# EAGLE design Aquila-2018-Under2 (EAGLE 9.1.1)
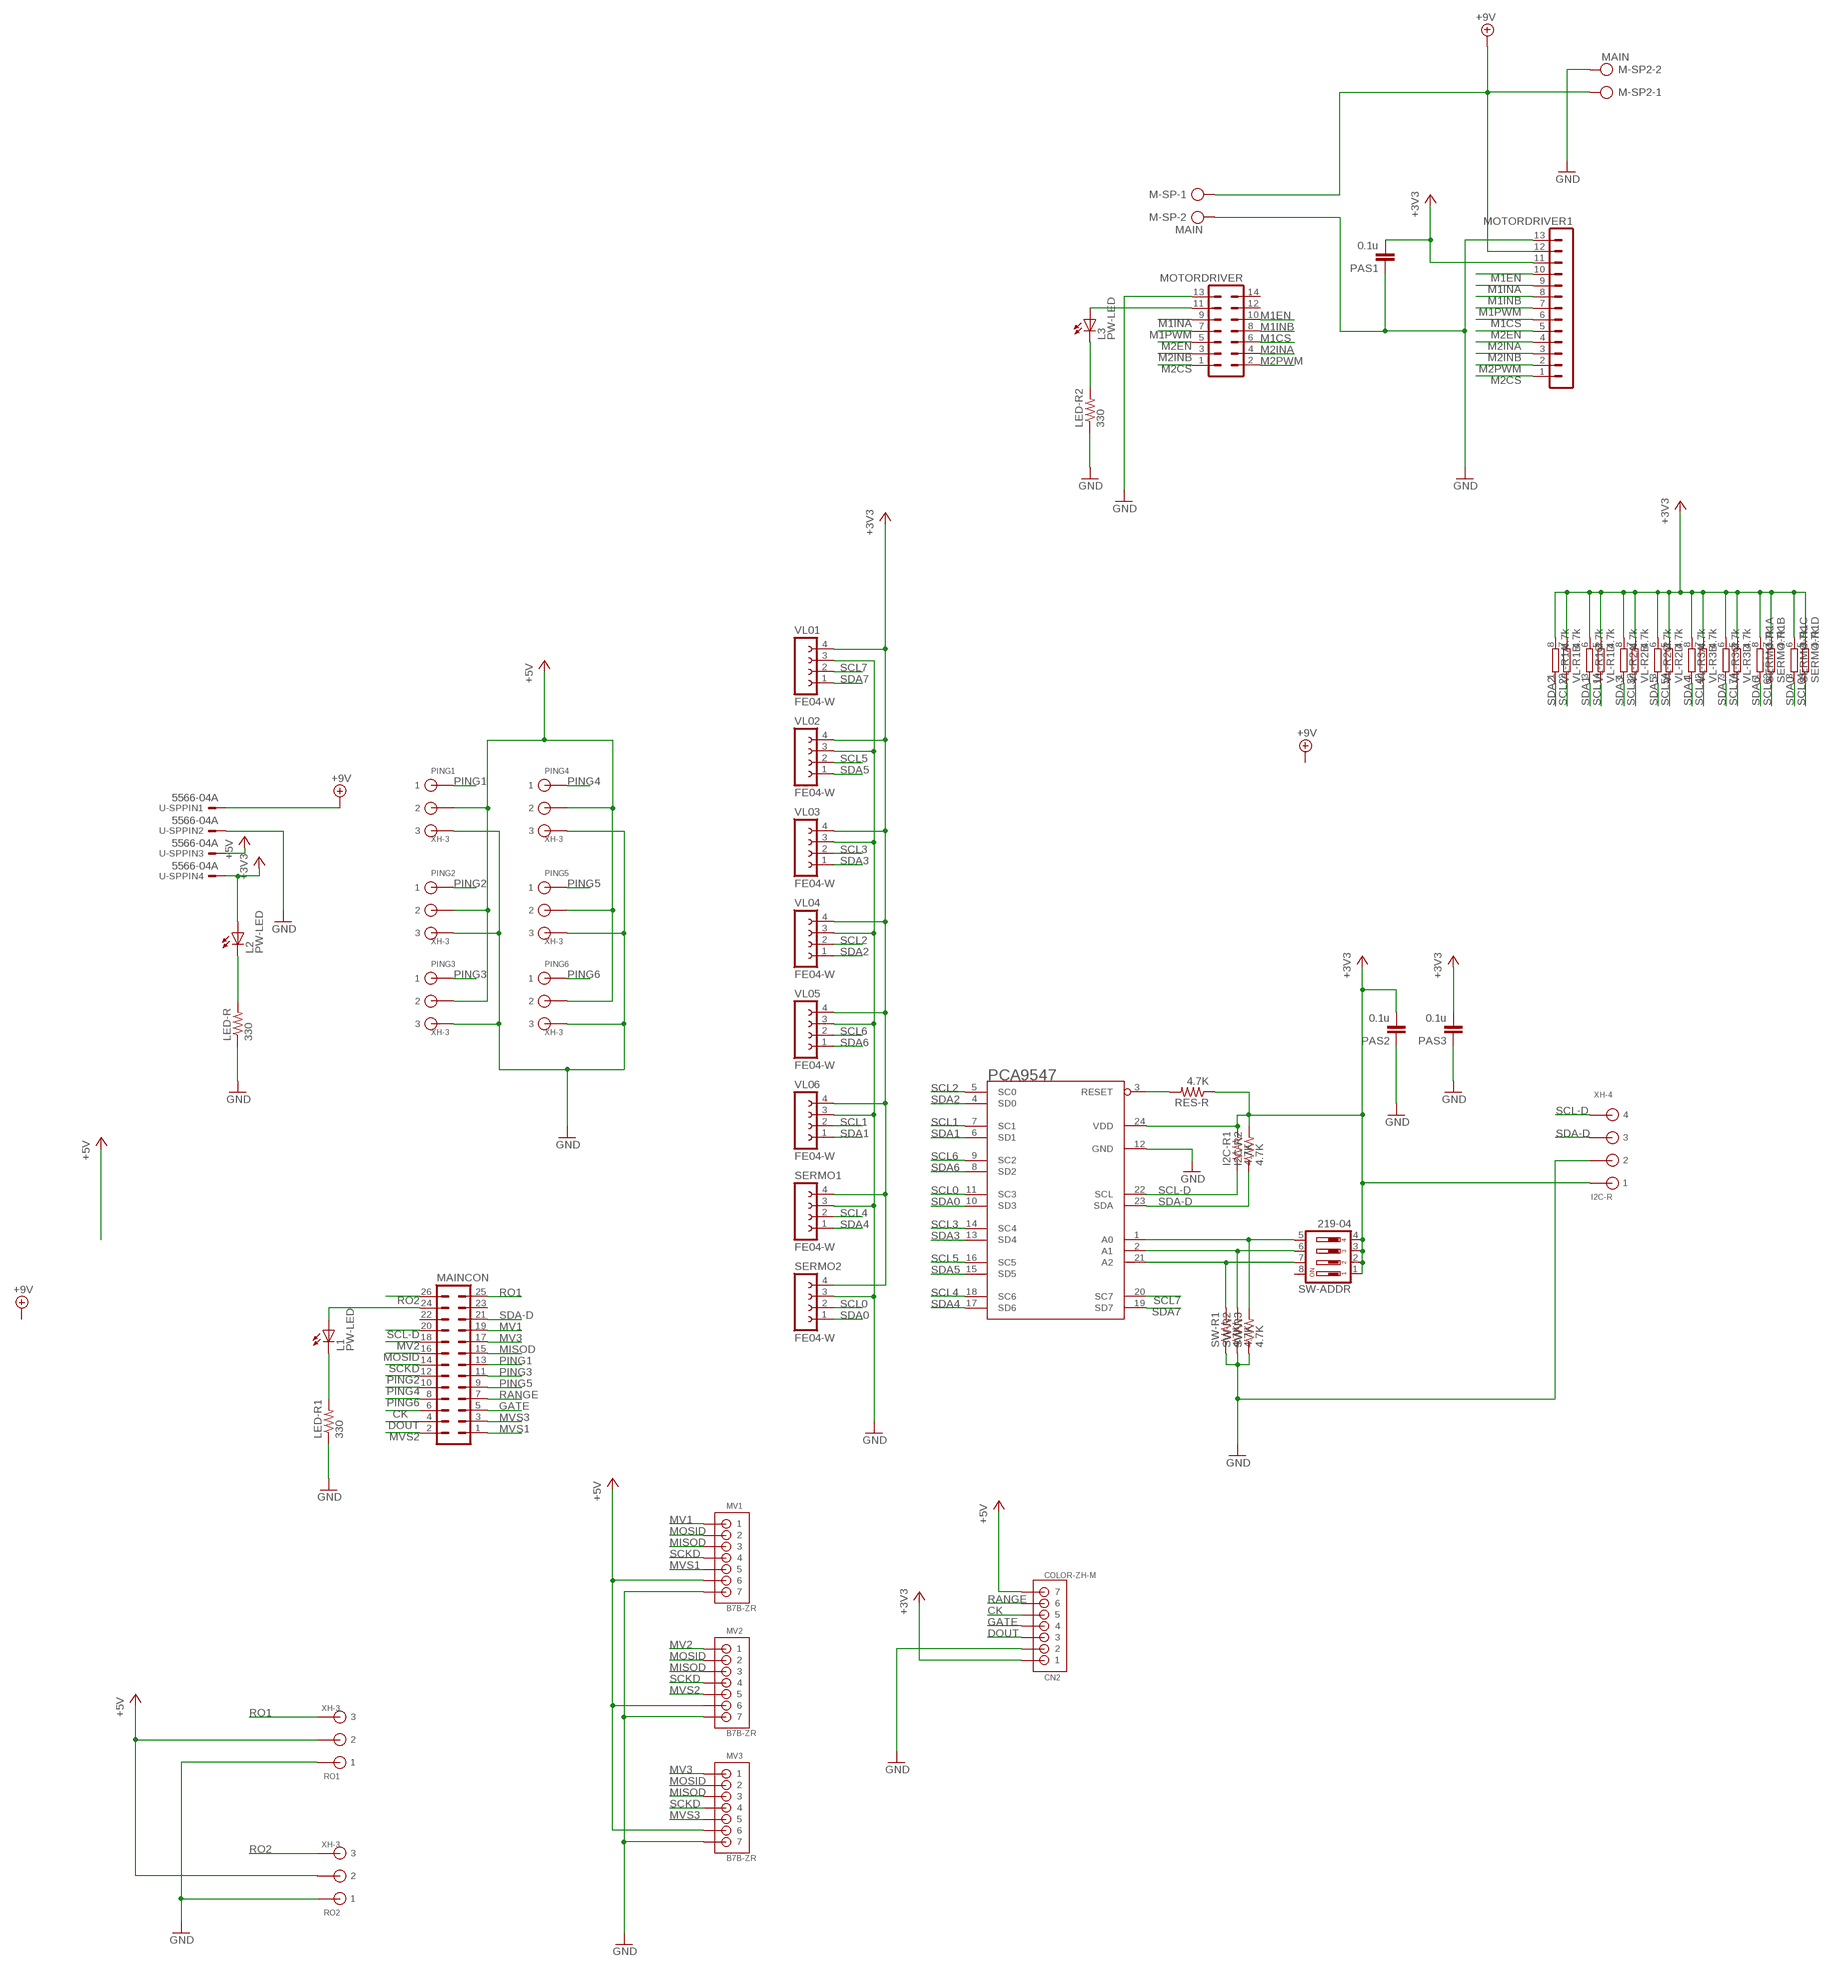
[diagram p0: schematic, sheet 1]

## Parts
CN2  COLOR-ZH-M  B7B-ZR  [B7B-ZR]
I2C-R  XH-4  [CON4]
I2C-R1  4.7K  R-US_R0805  [R0805]
I2C-R2  4.7K  R-US_R0805  [R0805]
L1  PW-LED  LEDCHIPLED_0805  [CHIPLED_0805]
L2  PW-LED  LEDCHIPLED_0805  [CHIPLED_0805]
L3  PW-LED  LEDCHIPLED_0805  [CHIPLED_0805]
LED-R  330  R-US_R0805  [R0805]
LED-R1  330  R-US_R0805  [R0805]
LED-R2  330  R-US_R0805  [R0805]
M-SP  MAIN  AK500/2  [AK500/2]
M-SP2  MAIN  AK500/2  [AK500/2]
MAINCON  ML26  [ML26]
MOTORDRIVER  ML14  [ML14]
MOTORDRIVER1  MA13-1  [MA13-1]
MV1  B7B-ZR  [B7B-ZR]
MV2  B7B-ZR  [B7B-ZR]
MV3  B7B-ZR  [B7B-ZR]
PAS1  0.1u  C-EUC0805  [C0805]
PAS2  0.1u  C-EUC0805  [C0805]
PAS3  0.1u  C-EUC0805  [C0805]
PCA9547  PCA9547  [SO24L]
PING1  XH-3  [CON3]
PING2  XH-3  [CON3]
PING3  XH-3  [CON3]
PING4  XH-3  [CON3]
PING5  XH-3  [CON3]
PING6  XH-3  [CON3]
RES-R  4.7K  R-US_R0805  [R0805]
RO1  XH-3  [CON3]
RO2  XH-3  [CON3]
SERMO1  FE04-W  [FE04-W]
SERMO2  FE04-W  [FE04-W]
SERMO-R1  4.7k  4R-NEXB28V  [EXB28V]
SW-ADDR  219-04  [CTS-219-04]
SW-R1  4.7K  R-US_R0805  [R0805]
SW-R2  4.7K  R-US_R0805  [R0805]
SW-R3  4.7K  R-US_R0805  [R0805]
U-SP  5566-04A  [5566-04A]
VL01  FE04-W  [FE04-W]
VL02  FE04-W  [FE04-W]
VL03  FE04-W  [FE04-W]
VL04  FE04-W  [FE04-W]
VL05  FE04-W  [FE04-W]
VL06  FE04-W  [FE04-W]
VL-R1  4.7k  4R-NEXB28V  [EXB28V]
VL-R2  4.7k  4R-NEXB28V  [EXB28V]
VL-R3  4.7k  4R-NEXB28V  [EXB28V]

## Nets
+3V3: CN2.1 I2C-R1.2 I2C-R2.2 I2C-R.P$1 L2.A MOTORDRIVER1.11 PAS1.2 PAS2.2 PAS3.2 PCA9547.24(VDD) RES-R.1 SERMO1.4 SERMO2.4 SERMO-R1.5 SERMO-R1.6 SERMO-R1.7 SERMO-R1.8 SW-ADDR.1 SW-ADDR.2 SW-ADDR.3 SW-ADDR.4 U-SP.4 VL01.4 VL02.4 VL03.4 VL04.4 VL05.4 VL06.4 VL-R1.5 VL-R1.6 VL-R1.7 VL-R1.8 VL-R2.5 VL-R2.6 VL-R2.7 VL-R2.8 VL-R3.5 VL-R3.6 VL-R3.7 VL-R3.8
+5V: CN2.7 MV1.6 MV2.6 MV3.6 PING1.P$2 PING2.P$2 PING3.P$2 PING4.P$2 PING5.P$2 PING6.P$2 RO1.P$2 RO2.P$2 U-SP.3
+9V: M-SP2.1 M-SP.1 MOTORDRIVER1.12 U-SP.1
CK: CN2.5 MAINCON.6
DOUT: CN2.3 MAINCON.4
GATE: CN2.4 MAINCON.5
GND: CN2.2 I2C-R.P$2 LED-R1.1 LED-R2.1 LED-R.1 M-SP2.2 M-SP.2 MOTORDRIVER1.13 MOTORDRIVER.13 MV1.7 MV2.7 MV3.7 PAS1.1 PAS2.1 PAS3.1 PCA9547.12(GND) PING1.P$3 PING2.P$3 PING3.P$3 PING4.P$3 PING5.P$3 PING6.P$3 RO1.P$1 RO2.P$1 SERMO1.3 SERMO2.3 SW-R1.1 SW-R2.1 SW-R3.1 U-SP.2 VL01.3 VL02.3 VL03.3 VL04.3 VL05.3 VL06.3
M1CS: MOTORDRIVER1.6 MOTORDRIVER.6
M1EN: MOTORDRIVER1.10 MOTORDRIVER.10
M1INA: MOTORDRIVER1.9 MOTORDRIVER.9
M1INB: MOTORDRIVER1.8 MOTORDRIVER.8
M1PWM: MOTORDRIVER1.7 MOTORDRIVER.7
M2CS: MOTORDRIVER1.1 MOTORDRIVER.1
M2EN: MOTORDRIVER1.5 MOTORDRIVER.5
M2INA: MOTORDRIVER1.4 MOTORDRIVER.4
M2INB: MOTORDRIVER1.3 MOTORDRIVER.3
M2PWM: MOTORDRIVER1.2 MOTORDRIVER.2
MISOD: MAINCON.15 MV1.3 MV2.3 MV3.3
MOSID: MAINCON.16 MV1.2 MV2.2 MV3.2
MV1: MAINCON.19 MV1.1
MV2: MAINCON.18 MV2.1
MV3: MAINCON.17 MV3.1
MVS1: MAINCON.1 MV1.5
MVS2: MAINCON.2 MV2.5
MVS3: MAINCON.3 MV3.5
N$1: PCA9547.1(A0) SW-ADDR.5 SW-R3.2
N$2: PCA9547.2(A1) SW-ADDR.6 SW-R2.2
N$3: PCA9547.21(A2) SW-ADDR.7 SW-R1.2
N$4: L2.C LED-R.2
N$5: PCA9547.3(RESET) RES-R.2
N$7: L1.C LED-R1.2
N$8: L1.A MAINCON.24
N$9: L3.C LED-R2.2
N$10: L3.A MOTORDRIVER.11
PING1: MAINCON.13 PING1.P$1
PING2: MAINCON.12 PING2.P$1
PING3: MAINCON.11 PING3.P$1
PING4: MAINCON.10 PING4.P$1
PING5: MAINCON.9 PING5.P$1
PING6: MAINCON.8 PING6.P$1
RANGE: CN2.6 MAINCON.7
RO1: MAINCON.25 RO1.P$3
RO2: MAINCON.26 RO2.P$3
SCKD: MAINCON.14 MV1.4 MV2.4 MV3.4
SCL0: PCA9547.11(SC3) SERMO2.2 SERMO-R1.4
SCL1: PCA9547.7(SC1) VL06.2 VL-R1.4
SCL2: PCA9547.5(SC0) VL04.2 VL-R1.2
SCL3: PCA9547.14(SC4) VL03.2 VL-R2.2
SCL4: PCA9547.18(SC6) SERMO1.2 VL-R3.2
SCL5: PCA9547.16(SC5) VL02.2 VL-R2.4
SCL6: PCA9547.9(SC2) SERMO-R1.2 VL05.2
SCL7: PCA9547.20(SC7) VL01.2 VL-R3.4
SCL-D: I2C-R1.1 I2C-R.P$4 MAINCON.20 PCA9547.22(SCL)
SDA0: PCA9547.10(SD3) SERMO2.1 SERMO-R1.3
SDA1: PCA9547.6(SD1) VL06.1 VL-R1.3
SDA2: PCA9547.4(SD0) VL04.1 VL-R1.1
SDA3: PCA9547.13(SD4) VL03.1 VL-R2.1
SDA4: PCA9547.17(SD6) SERMO1.1 VL-R3.1
SDA5: PCA9547.15(SD5) VL02.1 VL-R2.3
SDA6: PCA9547.8(SD2) SERMO-R1.1 VL05.1
SDA7: PCA9547.19(SD7) VL01.1 VL-R3.3
SDA-D: I2C-R2.1 I2C-R.P$3 MAINCON.21 PCA9547.23(SDA)
Unconnected: MAINCON.22 MAINCON.23 MOTORDRIVER.12 MOTORDRIVER.14 SW-ADDR.8

## Library data of the parts
CN2 MV1-MV3 = jst:B7B-ZR
I2C-R = 0@Mylibrary-main1:XH-4: Low insertion connector 4pin
I2C-R1 I2C-R2 LED-R LED-R1 LED-R2 RES-R SW-R1-SW-R3 = 0@Mylibrary-main1:R-US_: RESISTOR, American symbol
L1-L3 = led:LED: LED OSRAM: - CHIPLED LG R971, LG N971, LY N971, LG Q971, LY Q971, LO R971, LY R971 LH N974, LH R974 LS Q976, LO Q976, LY Q976 LO Q996 - Hyper CHIPLED LW Q18S LB Q993, LB Q99A, LB R99A - SideLED LS A670, LO A670, LY A670, LG A670, LP A670 LB A673, LV A673, LT A673, LW A673 LH A674 LY A675 LS A676, LA A676, LO A676, LY A676, LW A676 LS A679, LY A679, LG A679 - Hyper Micro SIDELED® LS Y876, LA Y876, LO Y876, LY Y876 LT Y87S - SmartLED LW L88C, LW L88S LB L89C, LB L89S, LG L890 LS L89K, LO L89K, LY L89K LS L896, LA L896, LO L896, LY L896 - TOPLED LS T670, LO T670, LY T670, LG T670, LP T670 LSG T670, LSP T670, LSY T670, LOP T670, LYG T670 LG T671, LOG T671, LSG T671 LB T673, LV T673, LT T673, LW T673 LH T674 LS T676, LA T676, LO T676, LY T676, LB T676, LH T676, LSB T676, LW T676 LB T67C, LV T67C, LT T67C, LS T67K, LO T67K, LY T67K, LW E67C LS E67B, LA E67B, LO E67B, LY E67B, LB E67C, LV E67C, LT E67C LW T67C LS T679, LY T679, LG T679 LS T770, LO T770, LY T770, LG T770, LP T770 LB T773, LV T773, LT T773, LW T773 LH T774 LS E675, LA E675, LY E675, LS T675 LS T776, LA T776, LO T776, LY T776, LB T776 LHGB T686 LT T68C, LB T68C - Hyper Mini TOPLED® LB M676 - Mini TOPLED Santana® LG M470 LS M47K, LO M47K, LY M47K Source: http://www.osram.convergy.de LUXEON: - LUMILED® LXK2-PW12-R00, LXK2-PW12-S00, LXK2-PW14-U00, LXK2-PW14-V00 LXK2-PM12-R00, LXK2-PM12-S00, LXK2-PM14-U00 LXK2-PE12-Q00, LXK2-PE12-R00, LXK2-PE12-S00, LXK2-PE14-T00, LXK2-PE14-U00 LXK2-PB12-K00, LXK2-PB12-L00, LXK2-PB12-M00, LXK2-PB14-N00, LXK2-PB14-P00, LXK2-PB14-Q00 LXK2-PR12-L00, LXK2-PR12-M00, LXK2-PR14-Q00, LXK2-PR14-R00 LXK2-PD12-Q00, LXK2-PD12-R00, LXK2-PD12-S00 LXK2-PH12-R00, LXK2-PH12-S00 LXK2-PL12-P00, LXK2-PL12-Q00, LXK2-PL12-R00 Source: www.luxeon.com KINGBRIGHT: KA-3528ASYC Source: www.kingbright.com
M-SP M-SP2 = con-ptr500:AK500/2: CONNECTOR; OC_FARNELL: unknown; OC_NEWARK: unknown
MAINCON = 0con-harting-ml:ML26: HARTING; OC_FARNELL: unknown; OC_NEWARK: unknown
MOTORDRIVER = 0con-harting-ml:ML14: HARTING; OC_FARNELL: unknown; OC_NEWARK: unknown
MOTORDRIVER1 = con-lstb-forprint:MA13-1: PIN HEADER; OC_FARNELL: unknown; OC_NEWARK: unknown
PAS1-PAS3 = rcl:C-EU: CAPACITOR, European symbol; SPICEPREFIX: B
PCA9547 = PCA9547:PCA9547: 8-channel I2C-Bus multiplexer with reset NXP
PING1-PING6 = 0@Mylibrary-main1:XH-3: low insertion CON
RO1 RO2 = forprint:XH-3: low insertion CON
SERMO1 SERMO2 VL01-VL06 = 0@con-lsta:FE04-W
SERMO-R1 VL-R1-VL-R3 = resistor-dil:4R-N: Array Chip Resistor Source: RS Component / Phycomp; OC_FARNELL: unknown; OC_NEWARK: unknown
SW-ADDR = switch-dil:219-04*: Surface Mount DIP Switch Series 219 SMT CTS Electronic Components Sourc: www.ctscorp.com; OC_FARNELL: unknown; OC_NEWARK: unknown
U-SP = con-molex:5566-04A

## Board
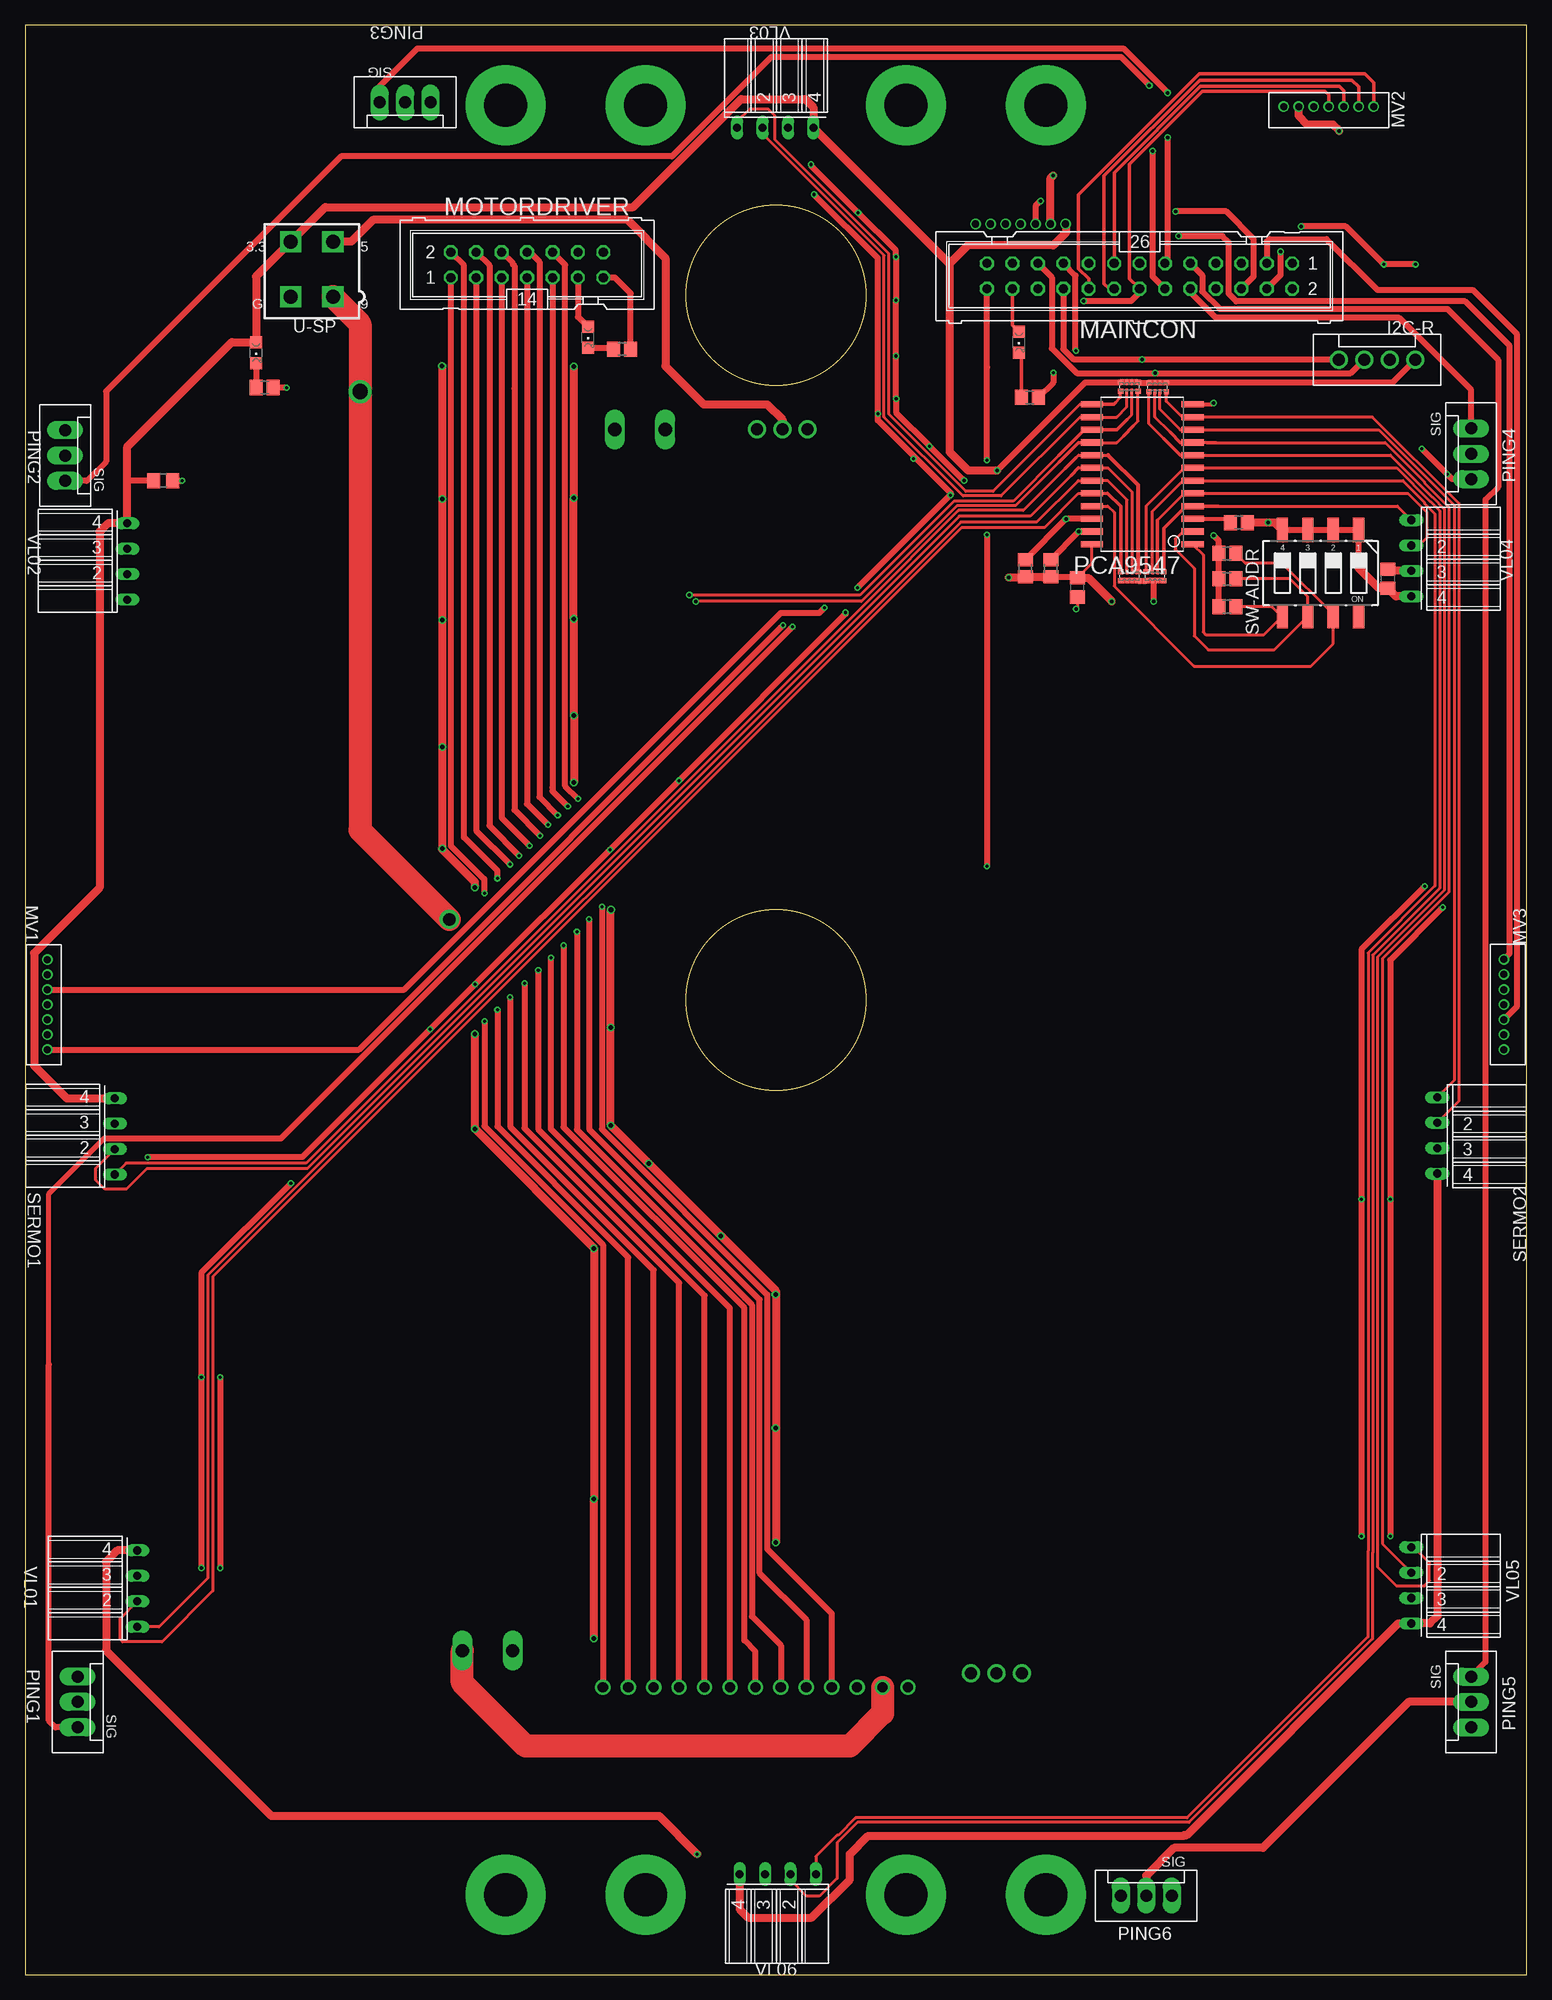
[diagram p1: board, top side]
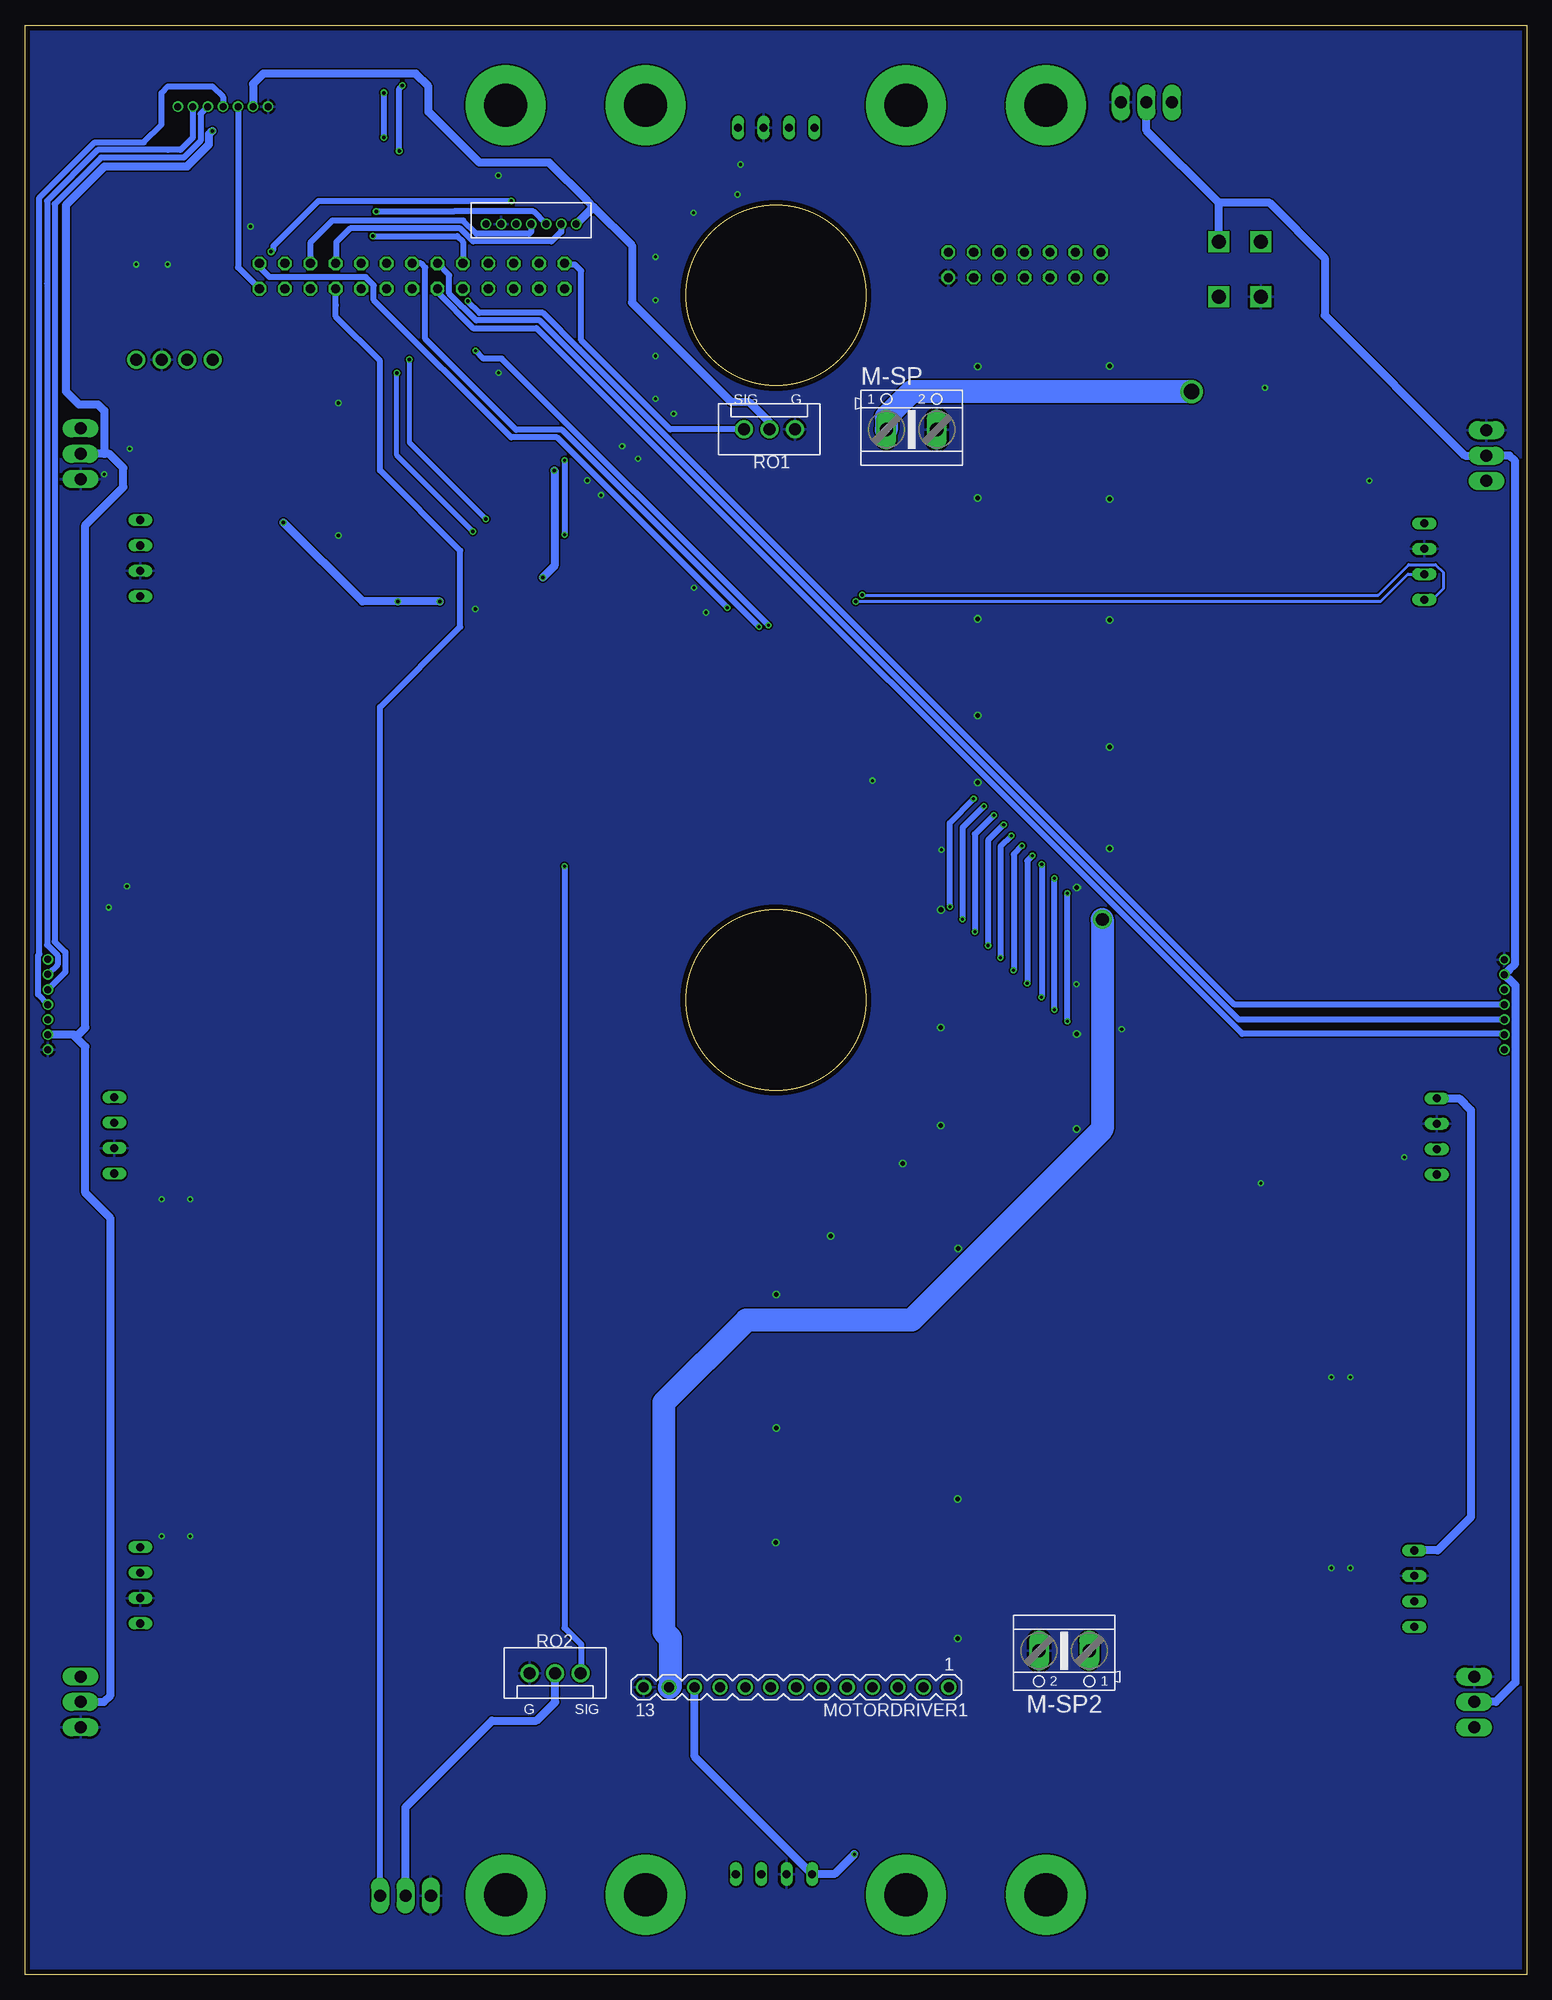
[diagram p2: board, bottom side, seen from below]

Size 150 x 194.72 mm. Coordinates in mm from the lower left corner, seen from the top.
Outline: 0,0 150,0 150,194.72 0,194.72 0,0
Outline: circle at 75,97.36 radius 9
Outline: circle at 75,167.72 radius 9
Copper layers (1*16): Top 0.035mm / dielectric 1.6mm / Bottom 0.035mm
Design rules "Elecrow_2-layer_PCB_eagle_rule": minimum track width 6mil, minimum drill 12mil, track to track 6mil, track to pad 6mil, pad to pad 6mil, via to via 8mil, smd to smd 0mil, copper to edge 20mil, drill to drill 10mil, minimum pad ring 6mil, minimum via ring 6mil, stop-mask expansion 0mil, vias tented up to drill 100mil, thermal gap 10mil

### Footprints (pad centres in the part's own frame; a part is rotated, then mirrored left to right if it is on the bottom)
B7B-ZR = drill 0.7: 1 10.5,-1.3; 2 9,-1.3; 3 7.5,-1.3; 4 6,-1.3; 5 4.5,-1.3; 6 3,-1.3; 7 1.5,-1.3
CON4 = drill 1.2: P$1 -3.81,0; P$2 -1.27,0; P$3 1.27,0; P$4 3.81,0
R0805 = smd 1.3 x 1.5: 1 -0.85,0; 2 0.85,0
CHIPLED_0805 = smd 1.2 x 1.2: A 0,-1.05; C 0,1.05
AK500/2 = drill 1.321 long: 1 -2.515,0; 2 2.515,0
ML26 = drill 0.914 octagon: 1 -15.24,-1.27; 2 -15.24,1.27; 3 -12.7,-1.27; 4 -12.7,1.27; 5 -10.16,-1.27; 6 -10.16,1.27; 7 -7.62,-1.27; 8 -7.62,1.27; 9 -5.08,-1.27; 10 -5.08,1.27; 11 -2.54,-1.27; 12 -2.54,1.27; 13 0,-1.27; 14 0,1.27; 15 2.54,-1.27; 16 2.54,1.27; 17 5.08,-1.27; 18 5.08,1.27; 19 7.62,-1.27; 20 7.62,1.27; 21 10.16,-1.27; 22 10.16,1.27; 23 12.7,-1.27; 24 12.7,1.27; 25 15.24,-1.27; 26 15.24,1.27
ML14 = drill 0.914 octagon: 1 -7.62,-1.27; 2 -7.62,1.27; 3 -5.08,-1.27; 4 -5.08,1.27; 5 -2.54,-1.27; 6 -2.54,1.27; 7 0,-1.27; 8 0,1.27; 9 2.54,-1.27; 10 2.54,1.27; 11 5.08,-1.27; 12 5.08,1.27; 13 7.62,-1.27; 14 7.62,1.27
MA13-1 = drill 1.016: 1 -15.24,0; 2 -12.7,0; 3 -10.16,0; 4 -7.62,0; 5 -5.08,0; 6 -2.54,0; 7 0,0; 8 2.54,0; 9 5.08,0; 10 7.62,0; 11 10.16,0; 12 12.7,0; 13 15.24,0
C0805 = smd 1.3 x 1.5: 1 -0.95,0; 2 0.95,0
SO24L = smd 0.61 x 2.21: 1 -6.985,-5.029; 2 -5.715,-5.029; 3 -4.445,-5.029; 4 -3.175,-5.029; 5 -1.905,-5.029; 6 -0.635,-5.029; 7 0.635,-5.029; 8 1.905,-5.029; 9 3.175,-5.029; 10 4.445,-5.029; 11 5.715,-5.029; 12 6.985,-5.029; 13 6.985,5.029; 14 5.715,5.029; 15 4.445,5.029; 16 3.175,5.029; 17 1.905,5.029; 18 0.635,5.029; 19 -0.635,5.029; 20 -1.905,5.029; 21 -3.175,5.029; 22 -4.445,5.029; 23 -5.715,5.029; 24 -6.985,5.029
CON3 = drill 1.2 long: P$1 -2.54,0; P$2 0,0; P$3 2.54,0
CON3' = drill 1.2: P$1 -2.54,0; P$2 0,0; P$3 2.54,0
FE04-W = drill 0.813 long: 1 1.27,-1.27; 2 3.81,-1.27; 3 6.35,-1.27; 4 8.89,-1.27
EXB28V = smd 0.525 x 0.5: 1 -0.875,-0.45; 4 0.875,-0.45; 5 0.875,0.45; 8 -0.875,0.45 | smd 0.25 x 0.5: 2 -0.25,-0.45; 3 0.25,-0.45; 6 0.25,0.45; 7 -0.25,0.45
CTS-219-04 = smd 1.13 x 2.44: 1 -3.81,-4.3; 2 -1.27,-4.3; 3 1.27,-4.3; 4 3.81,-4.3; 5 3.81,4.3; 6 1.27,4.3; 7 -1.27,4.3; 8 -3.81,4.3
5566-04A = drill 1.4 square: 1 2.1,-2.75; 2 -2.1,-2.75; 3 2.1,2.75; 4 -2.1,2.75

### Placement (x,y rotation side)
CN2  93.44,173.55 180 bottom
I2C-R  135.06,161.31 180 top
I2C-R1  99.92,140.46 270 top
I2C-R2  102.46,140.46 270 top
L1  99.28,163.07 180 top
L2  23.08,162.01 180 top
L3  56.24,163.53 180 top
LED-R  23.93,158.53 180 top
LED-R1  100.37,157.53 180 top
LED-R2  59.66,162.37 180 top
M-SP  61.44,154.33 0 bottom
M-SP2  46.2,32.38 180 bottom
MAINCON  111.34,169.65 180 top
MOTORDRIVER  50.15,170.77 0 top
MOTORDRIVER1  72.96,28.73 180 bottom
MV1  3.53,102.9 270 top
MV2  124.23,187.88 0 top
MV3  146.42,90.91 90 top
PAS1  136.11,139.45 270 top
PAS2  105.12,138.56 90 top
PAS3  13.81,149.22 180 top
PCA9547  111.6,149.86 90 top
PING1  5.25,27.26 90 top
PING2  4.01,151.73 90 top
PING3  37.97,187 0 top
PING4  144.45,151.91 270 top
PING5  144.45,27.26 270 top
PING6  112,7.92 180 top
RES-R  121.25,145.03 180 top
RO1  XH-3  [CON3']  75.64,154.35 180 bottom
RO2  XH-3  [CON3']  97.05,30.15 0 bottom
SERMO1  7.7,78.66 90 top
SERMO2  142.35,88.92 270 top
SERMO-R1  113.13,158.57 0 top
SW-ADDR  129.41,139.99 180 top
SW-R1  120.09,141.95 0 top
SW-R2  120.09,139.41 0 top
SW-R3  120.08,136.63 0 top
U-SP  28.66,170.34 0 top
VL01  9.95,33.5 90 top
VL02  8.95,136.07 90 top
VL03  69.87,185.75 0 top
VL04  139.75,146.56 270 top
VL05  139.75,43.99 270 top
VL06  80.27,8.8 180 top
VL-R1  112.87,139.7 180 top
VL-R2  110.32,158.58 0 top
VL-R3  110.33,139.7 180 top

### Tracks (layer width: path | path; a pad name or v marks a point on that pad's centre or on a via)
+3V3  (via drill 0.3, 0.35)
  Top 0.305: 105.02,139.61 PAS2.2 106.57,140.96 PCA9547.24
  Top 0.61: PAS3.2 10.22,149.22 | SW-ADDR.4 SW-ADDR.3 SW-ADDR.2 SW-ADDR.1 133.22,140.49 | VL-R1.8 VL-R1.7 112.74,139.25 | 112.74,139.25 VL-R1.6 VL-R1.5 VL-R3.8 VL-R3.7 VL-R3.6 VL-R3.5 | I2C-R1.2 I2C-R2.2 105.02,139.61 | I2C-R.P$1 136.58,159.02 SERMO-R1.5 SERMO-R1.6 SERMO-R1.7 SERMO-R1.8 111.2,159.02 VL-R2.5 VL-R2.6 VL-R2.7 VL-R2.8 105.91,159.03 v97.12,150.24 | v112.74,137.16 112.74,139.25
  Top 0.813: SERMO1.4 4.17,87.55 0.91,90.81 0.91,102.04 7.46,108.58 7.46,144.15 8.28,144.96 VL02.4 10.22,149.22 10.22,152.62 20.66,163.06 L2.A 23.08,169.62 U-SP.4 29.99,176.53 60.75,176.53 71.55,187.32 77.94,187.32 78.76,186.51 VL03.4 92.34,170.9 | VL01.4 9.21,42.39 8.1,41.27 8.1,32.38 24.61,15.88 63.34,15.88 v67.15,12.06 | VL06.4 71.38,6.57 72.23,5.71 78.58,5.71 82.39,9.53 82.39,12.06 84.21,13.88 115.71,13.88 115.8,13.97 116.05,13.97 137.18,35.1 VL05.4 140.35,35.1 141.08,35.83 SERMO2.4 | CN2.1 103.98,174.82 103.98,173.99 102.71,172.72 94.17,172.72 92.34,170.9 | 92.34,170.9 92.34,152.1 94.2,150.24 v97.12,150.24 | 101.69,139.57 101.73,139.61 I2C-R1.2 99.88,139.57 v98.27,139.57 | PAS2.2 106.2,139.51 v108.55,137.16 | SW-ADDR.4 124.85,145.03 v124.17,145.03 RES-R.1 | VL04.4 136.94,137.67 PAS1.2 135.22,138.5 133.22,140.49
  Bottom 0.813: SERMO1.4 6.75,87.55 5.55,86.36 5.55,45.72 8.88,42.39 VL01.4 | v67.15,12.06 69.15,10.07 VL06.4 83.12,21.81 MOTORDRIVER1.11 | v98.27,139.57 97.12,140.72 v97.12,150.24 | v108.55,137.16 v112.74,137.16 116.3,137.16 v124.17,145.03
+5V  (via drill 0.35)
  Top 0.813: PING5.P$2 138.22,27.26 123.67,12.7 114.78,12.7 112,9.93 PING6.P$2 | U-SP.3 32.6,173.09 34.77,175.26 60.16,175.26 63.98,171.45 63.98,160.66 67.78,156.84 74.14,156.84 75.64,155.34 RO1.P$2 | MV2.6 127.23,185.66 128.11,184.78 130.65,184.78 v131.28,184.15
  Bottom 0.813: U-SP.3 30.75,176.97 | PING3.P$2 37.97,184.18 30.75,176.97 | 30.75,176.97 25.68,176.97 20.16,171.45 20.16,165.74 6.16,151.73 PING2.P$2 1.71,151.73 1.15,151.17 1.15,100.95 1.78,100.32 1.81,100.32 MV1.6 1.81,99.48 1.78,99.48 1.11,98.81 1.11,29.21 3.06,27.26 PING1.P$2 | PING5.P$2 142.12,27.26 141.44,27.94 141.44,75.56 143.99,78.11 143.99,92.71 145.19,93.91 | 145.19,93.91 MV3.6 | 145.19,93.91 144.69,93.91 143.99,94.61 143.99,144.78 140.18,148.59 140.18,150.5 141.59,151.91 142.08,151.91 | 142.08,151.91 PING4.P$2 | MV2.6 127.23,188.84 126.2,189.87 110.97,189.87 109.69,188.59 109.69,186.06 104.61,180.97 97.63,180.97 93.82,177.16 93.19,176.53 | 93.19,176.53 89.38,172.72 89.38,167 79.47,157.1 77.69,157.1 75.64,155.05 RO1.P$2 | 142.08,151.91 142.08,156.21 142.72,156.84 144.62,156.84 145.89,158.12 145.89,176.77 142.04,180.62 133.79,180.62 131.6,182.8 131.6,183.83 v131.28,184.15 | CN2.7 93.27,176.53 93.19,176.53 | RO2.P$2 97.05,27.25 98.9,25.4 103.34,25.4 112,16.75 PING6.P$2
+9V  (via drill 1.27, 1.52)
  Top 2.286: U-SP.1 33.47,164.88 v33.47,158.12 33.47,114.33 | 33.47,114.33 | v42.38,105.41 33.47,114.33 | MOTORDRIVER1.12 85.66,26.13 82.39,22.86 50.01,22.86 43.68,29.18 M-SP2.1
  Bottom 2.286: 86.2,43.81 86.2,57.15 77.94,65.41 61.44,65.41 42.38,84.45 v42.38,105.41 | 86.2,43.81 | 86.2,43.81 86.2,34.29 85.56,33.66 85.56,28.82 MOTORDRIVER1.12 | v33.47,158.12 61.44,158.12 63.95,155.6 M-SP.1
CK  (via drill 0.35)
  Top 0.61: v114.92,176.11 119.98,176.11 122.72,173.37 122.72,169.6 MAINCON.6
  Bottom 0.61: v114.92,176.11 107.16,176.11 99.2,176.11 CN2.5
DOUT  (via drill 0.35)
  Top 0.61: v125.41,172.09 125.41,169.75 MAINCON.4 | v101.44,177.16 100.94,176.67 CN2.3
  Bottom 0.61: v125.41,172.09 125.18,172.32 125.18,172.66 120.68,177.16 v101.44,177.16
GATE
  Bottom 0.61: MAINCON.5 121.5,172.98 119.3,175.18 106.22,175.18 104.91,173.87 99.65,173.87 99.44,174.08 CN2.4
GND  (via drill 0.3, 0.35, 0.45, 0.5)
  Top 0.305: PAS2.1 105.12,136.53 v105,136.4 | v93.83,149.24 93.78,149.24 93.64,149.38
  Top 0.406: PCA9547.12 118.58,156.84 v118.71,156.97
  Top 0.61: v141.62,106.6 136.37,101.35 v136.37,77.47 v136.37,43.81 | v139.82,108.74 133.51,102.42 v133.51,77.47 v133.51,43.81 | v26.56,79.05 17.62,70.1 v17.62,59.69 v17.62,40.64 | v19.51,59.69 v19.51,40.64 | v83.15,138.52 92.53,147.9 85.2,155.24 85.2,171.44 v78.83,177.8 | LED-R2.1 60.51,167.93 58.94,169.5 MOTORDRIVER.13 | v138.91,170.81 v135.73,170.81 131.92,174.62 v127.47,174.62 | LED-R1.1 102.71,159.02 v102.71,160.02 | LED-R.1 v26.12,158.53 v26.13,158.52 | PAS3.1 v15.71,149.22 | v139.54,152.4 v142.08,149.86 142.57,149.37 PING4.P$3 | 87.01,161.68 v87.01,167.25 87.01,171.55 v87,171.56 87,172.22 v83.23,176 78.53,180.7 v78.53,180.8 | 87.01,161.68 87.03,161.67 v87.03,157.42 87.03,156.02 90.34,152.71 v90.34,152.68 93.64,149.38 | SW-R3.1 SW-R2.1 SW-R1.1 119.24,143.24 v118.71,143.76 | v12.23,81.67 27.7,81.67 v40.45,94.42 40.47,94.42 v44.96,98.92 44.98,98.92 v58.44,112.38 v65.33,119.28 81.97,135.91 v81.97,136.06 | v87,161.67 87,161.7 87.01,161.68
  Top 0.813: v41.66,160.68 41.66,112.42 44.92,109.16 v44.92,108.58 | v56.84,33.58 v56.84,47.55 56.84,72.58 v44.94,84.48 44.94,93.97 v44.92,93.98 | v54.82,160.63 v54.82,147.47 v54.82,135.43 54.83,135.42 v54.83,125.79 v54.83,119.09 | v102.71,179.71 102.44,179.44 CN2.2 | v58.53,106.39 58.51,106.37 v58.51,94.6 v58.51,84.84 62.32,81.03 v62.32,81.01 69.51,73.83 v69.51,73.8 75,68.31 v75,43.18 | VL04.3 136.3,140.21 PAS1.1
  other vias: 92.45,147.79 85.2,155.89 88.75,151.42 41.67,112.47 41.67,122.63 41.67,135.33 41.67,147.4 74.97,54.61 74.97,67.94 56.8,72.54
  pour Bottom: 151,195 151,-1 0,-1 0,195
M1CS  (via drill 0.3)
  Top 0.61: MOTORDRIVER.6 48.73,170.91 48.73,170.81 48.89,170.66 48.89,158.41 48.89,116.36 v51.47,113.78 | v52.55,101.6 52.55,84.45 70.42,66.58 MOTORDRIVER1.6
  Bottom 0.61: v51.47,113.78 52.55,112.7 v52.55,101.6
M1EN  (via drill 0.3)
  Top 0.61: MOTORDRIVER.10 53.95,170.78 53.95,118.75 53.95,118.73 v55.24,117.45 | v57.62,106.68 57.62,84.45 74.14,67.94 74.14,42.55 80.58,36.1 MOTORDRIVER1.10
  Bottom 0.61: v57.62,106.68 57.62,115.06 v55.24,117.45
M1INA  (via drill 0.3)
  Top 0.61: MOTORDRIVER.9 52.69,118.6 | v56.35,105.44 56.35,84.45 73.37,67.44 73.37,40.13 78.04,35.47 MOTORDRIVER1.9 | 52.69,118.6 | 52.69,118.6 52.69,118.23 v54.22,116.7
  Bottom 0.61: v54.22,116.7 56.35,114.57 v56.35,105.44
M1INB  (via drill 0.3)
  Top 0.61: MOTORDRIVER.8 50.43,172.04 51.39,171.08 51.39,117.65 v53.22,115.82 | v55.12,104.17 55.12,84.42 71.91,67.63 72.61,66.93 72.61,35.81 75.5,32.92 MOTORDRIVER1.8
  Bottom 0.61: v53.22,115.82 55.12,113.92 v55.12,104.17
M1PWM  (via drill 0.3)
  Top 0.61: MOTORDRIVER.7 50.15,116.94 v52.24,114.85 | v53.79,102.81 53.79,84.67 71.85,66.61 71.85,33.4 72.96,32.29 MOTORDRIVER1.7
  Bottom 0.61: v52.24,114.85 53.79,113.3 v53.79,102.81
M2CS  (via drill 0.3)
  Top 0.61: MOTORDRIVER.1 42.53,112.78 45.83,109.49 | v45.89,95.22 45.89,84.76 57.72,72.93 MOTORDRIVER1.1 | 45.83,109.49 | v45.89,108.04 45.89,109.42 45.83,109.49
  Bottom 0.61: v45.89,95.22 v45.89,108.04
M2EN  (via drill 0.3)
  Top 0.61: MOTORDRIVER.5 47.61,115.54 v50.4,112.75 | v51.27,100.33 51.27,84.45 67.88,67.85 MOTORDRIVER1.5
  Bottom 0.61: v50.4,112.75 51.24,111.91 51.24,100.32 51.26,100.32 v51.27,100.33
M2INA  (via drill 0.3)
  Top 0.61: MOTORDRIVER.4 46.39,170.72 46.39,114.77 v49.37,111.78 | v49.89,99.02 49.89,84.57 64.93,69.53 | 64.93,69.53 65.34,69.12 | MOTORDRIVER1.4 65.34,69.12 | 65.34,69.12 64.93,69.53
  Bottom 0.61: v49.37,111.78 49.89,111.27 v49.89,99.02
M2INB  (via drill 0.3)
  Top 0.61: MOTORDRIVER.3 45.07,114.27 v48.44,110.9 | v48.47,97.65 48.47,84.72 62.8,70.39 MOTORDRIVER1.3
  Bottom 0.61: v48.44,110.9 48.44,97.68 v48.47,97.65
M2PWM  (via drill 0.3)
  Top 0.61: MOTORDRIVER.2 43.85,170.72 43.85,113.61 47.19,110.27 v47.19,109.5 | v47.19,96.41 47.19,84.73 58.58,73.34 59.53,72.39 | 60.26,71.66 59.53,72.39 | MOTORDRIVER1.2 60.26,71.66 | 60.26,71.66 59.53,72.39
  Bottom 0.61: v47.19,96.41 v47.19,109.5
MISOD
  Top 0.33: MV2.3 131.73,188.15 131.28,188.59 117.41,188.59 108.8,179.99 MAINCON.15
  Bottom 0.61: MV1.3 28.76,95.4 51.37,118.01 98.04,164.69 | 98.04,164.69 | 98.04,164.69 98.58,165.23 104.93,165.23 107.61,167.91 107.61,169.73 MAINCON.15 | MV3.3 145.98,100.15 145.98,102.13 147.03,103.19 147.03,176.85 142.4,181.48 134.14,181.48 132.47,183.16 132.47,185.84 MV2.3
MOSID
  Top 0.33: MV2.2 133.23,188.56 132.56,189.23 117.36,189.23 107.79,179.66 107.79,168.91 108.32,168.38 MAINCON.16
  Bottom 0.61: MV1.2 2.31,93.98 28.41,93.98 98.9,164.47 105.25,164.47 108.8,168.01 MAINCON.16 | MV2.2 133.23,183.47 134.46,182.25 135.73,182.25 142.72,182.25 147.79,177.16 147.79,168.91 147.79,102.87 146.74,101.82 146.74,100.89 MV3.2
MV1  (via drill 0.3)
  Top 0.61: MV1.1 33.36,92.4 v75.74,134.78 | MAINCON.19 104.95,169.69 104.95,162.23 v105,162.18
  Bottom 0.61: v105,162.18 104.23,161.42 102.38,161.42 v75.74,134.78
MV2
  Top 0.33: MV2.1 134.73,188.96 133.82,189.87 117.31,189.87 105.25,177.8 105.25,170.41 106.26,169.4 MAINCON.18
MV3  (via drill 0.35)
  Top 0.61: MV3.1 148.3,101.99 148.3,162.69 143.86,167.13 121,167.13 120.24,167.89 120.24,173.03 119.63,173.63 v115.25,173.63
  Bottom 0.61: v115.25,173.63 106.83,173.63 106.26,173.07 MAINCON.17
MVS1  (via drill 0.3)
  Top 0.61: MV1.5 37.89,98.4 75.51,136.02 79.34,136.02 v79.85,136.53
  Bottom 0.61: MAINCON.1 126.58,170.56 125.57,169.54 115.97,169.54 115.16,168.73 115.16,167.26 101.44,153.54 96.87,153.54 v79.85,136.53
MVS2
  Bottom 0.61: MAINCON.2 128.73,170.53 MV2.5
MVS3
  Top 0.61: MV3.5 149.06,96.75 149.06,163.83 144.62,168.28 135.09,168.28 130.01,173.35 124.3,173.35 124.04,173.09 MAINCON.3
N$1
  Top 0.305: SW-R3.2 124.53,136.62 124.55,136.65 125.52,135.69 SW-ADDR.5 123.77,133.86 117.95,133.86 117.7,134.11 117.7,141.81 PCA9547.1
N$2
  Top 0.305: SW-R2.2 126.36,139.41 128.14,137.64 SW-ADDR.6 124.79,132.33 118.2,132.33 116.81,133.73 116.81,140.46 114.9,142.37 114.9,143.38 115.66,144.15 PCA9547.2
N$3
  Top 0.305: PCA9547.21 108.17,146.69 108.81,146.05 108.81,138.68 116.78,130.71 128.44,130.71 130.68,132.94 SW-ADDR.7 130.68,135.86 125.57,140.97 121.92,140.97 SW-R1.2
N$4
  Top 0.61: L2.C LED-R.2
N$5
  Top 0.406: PCA9547.3 120.2,145.41 RES-R.2
N$6  (via drill 4.3 pad 8)
  other vias: 62,186.72
N$7
  Top 0.33: L1.C 99.52,161.78 LED-R1.2
N$8
  Top 0.33: L1.A 98.64,164.76 MAINCON.24
N$9
  Top 0.61: L3.C 58.7,162.47 LED-R2.2
N$10
  Top 0.61: MOTORDRIVER.11 55.23,165.59 L3.A
N$11  (via drill 4.3 pad 8)
  other vias: 62,8
N$12  (via drill 4.3 pad 8)
  other vias: 88,8
N$13  (via drill 4.3 pad 8)
  other vias: 48,8
N$14  (via drill 4.3 pad 8)
  other vias: 102,8
N$15  (via drill 4.3 pad 8)
  other vias: 102,186.72
N$16  (via drill 4.3 pad 8)
  other vias: 88,186.72
N$17  (via drill 4.3 pad 8)
  other vias: 48,186.72
PING1  (via drill 0.3)
  Top 0.508: 2.38,60.96 2.38,78 7.92,83.54
  Top 0.61: PING1.P$1 3.06,24.72 2.38,25.4 2.38,60.96 | v76.67,134.63 25.58,83.54 7.92,83.54
  Bottom 0.61: v76.67,134.63 96.35,154.31 100.93,154.31 110.01,163.39 110.01,170.5 110.44,170.92 MAINCON.13
PING2  (via drill 0.35)
  Top 0.61: PING2.P$1 6.16,149.19 8.1,151.13 8.1,158.13 31.57,181.61 64.61,181.61 74.55,191.55 109.47,191.55 112.31,188.71 v112.31,188.68 | MAINCON.12 112.63,169.63 v112.63,182.14
  Bottom 0.61: v112.63,182.14 112.63,188.36 v112.31,188.68
PING3  (via drill 0.35)
  Top 0.61: PING3.P$1 35.43,188.62 39.21,192.41 109.69,192.41 v114.14,187.96 | MAINCON.11 114.14,171.18 v114.14,183.51
  Bottom 0.61: v114.14,183.51 v114.14,187.96
PING4
  Top 0.61: PING4.P$1 144.45,158.28 137.27,165.47 118.97,165.47 116.42,168.01 MAINCON.10
PING5
  Top 0.61: PING5.P$1 145.89,31.24 145.89,147.32 147.16,148.59 147.16,161.29 142.08,166.37 119.33,166.37 117.59,168.11 117.59,169.75 MAINCON.9
PING6
  Bottom 0.61: MAINCON.8 118.96,166.75 118.97,166.74 118.97,165.61 114.54,161.18 114.54,150.26 106.52,142.24 106.52,134.62 114.54,126.6 PING6.P$1
RANGE
  Bottom 0.61: MAINCON.7 118.9,170.98 118.9,173.04 117.52,174.42 106.53,174.42 105.22,173.11 97.41,173.11 96.44,174.07 CN2.6
RO1
  Bottom 0.61: MAINCON.25 96,170.81 95.09,170.81 94.45,170.18 94.45,163.25 85.55,154.35 RO1.P$3
RO2  (via drill 0.3)
  Top 0.61: v96.11,143.83 v96.11,110.72 | MAINCON.26 96.1,160.55 v96.1,151.28
  Bottom 0.61: v96.1,151.28 v96.1,143.83 v96.11,143.83 | v96.11,110.72 96.11,34.67 94.45,33.02 94.45,30.2 RO2.P$3
SCKD  (via drill 0.35)
  Top 0.33: MV2.4 130.23,187.75 129.86,188.11 117.61,188.11 110.33,180.83 110.33,169.39 111.2,168.51 MAINCON.14
  Top 0.61: v105.77,167.17 110.5,167.17 111.2,167.88 111.2,168.51
  Bottom 0.61: MV1.4 29.18,96.9 82.27,149.99 94.65,162.37 98.27,165.99 104.61,165.99 105.77,167.15 v105.77,167.17 | MV3.4 148.7,97.89 148.7,101.82 148.56,101.96 148.56,177.48 143.03,183.01 138.14,183.01 136.37,184.78 136.37,187.96 135.73,188.59 131.28,188.59 130.23,187.54 MV2.4
SCL0
  Top 0.305: SERMO-R1.4 114.01,157.15 115.59,155.57 PCA9547.11 134.61,155.57 143.21,146.97 143.21,87.24 SERMO2.2
SCL1
  Top 0.305: VL06.2 76.46,9.49 78.07,7.87 79.34,7.87 81.12,9.65 81.12,13.21 83.15,15.24 116.27,15.24 134.6,33.57 134.6,42.14 134.62,42.16 134.62,101.84 141.31,108.52 141.31,146.22 140.37,147.16 140.35,147.16 137.01,150.5 PCA9547.7 115.79,150.5 112,146.7 VL-R1.4
SCL2
  Top 0.305: VL04.2 139.29,142.75 140.05,143.51 140.05,146.05 138.14,147.96 PCA9547.5 115.79,147.96 113.12,145.28
  Top 0.33: VL-R1.2 113.12,145.28
SCL3
  Top 0.305: VL-R2.2 110.07,156.58 109.06,155.57 PCA9547.14 105.38,155.57 97.5,147.7 93.69,147.7 85.82,155.57 85.82,171.72 73.68,183.86 VL03.2
SCL4
  Top 0.305: VL-R3.2 110.58,148.1 108.19,150.5 PCA9547.18 105.25,150.5 | 104.54,149.79 100.43,145.67 93.34,145.67 28.18,80.52 12.16,80.52 10.13,78.49 7.97,78.49 7.08,79.38 7.08,80.58 SERMO1.2
  Top 0.33: 104.54,149.79 105.25,150.5
SCL5  (via drill 0.35)
  Top 0.305: 110.68,154.66 111.19,155.17 VL-R2.4 | PCA9547.16 109.06,153.03 109.76,153.73 | 103.34,151.13 98.95,146.74 93.11,146.74 83.53,137.16 v67.02,137.16
  Top 0.33: PCA9547.16 105.25,153.03 103.34,151.13 | 109.76,153.73 110.68,154.66
  Bottom 0.305: VL02.2 11.85,139.88 14.57,137.16 v67.02,137.16
SCL6
  Top 0.305: 118.98,153.02 135.87,153.02 139.79,149.1 139.79,149.02 142.25,146.57 142.25,108.13 135.59,101.48 135.59,43.07 VL05.2 | 114.41,154.04 112.89,155.56 SERMO-R1.2 | 118.08,153.02 116.64,153.02 PCA9547.9 115.41,153.03
  Top 0.33: 118.98,153.02 118.08,153.02 | 115.41,153.03 114.41,154.04
SCL7
  Top 0.305: VL01.2 9.49,35.58 9.49,33.53 9.75,33.27 13.68,33.27 18.76,38.35 18.76,69.74 93.55,144.53 101.82,144.53 105.25,147.96 PCA9547.20 108.15,147.96
  Top 0.33: VL-R3.4 109.45,146.65 108.15,147.96
SCL-D  (via drill 0.35)
  Top 0.61: PCA9547.22 v103.98,145.41 99.92,141.35 I2C-R1.1 | I2C-R.P$4 v111.6,161.31 104.78,161.31 103.73,162.37 MAINCON.20
  Bottom 0.508: v111.6,161.31 111.6,153.03 v103.98,145.41
SDA0
  Top 0.305: SERMO-R1.3 113.39,156.33 115.41,154.31 PCA9547.10 135.23,154.31 142.75,146.78 142.75,89.32 SERMO2.1
SDA1
  Top 0.305: VL06.1 79,11.85 81.12,13.97 81.23,13.97 82.96,15.7 116.08,15.7 134.14,33.76 134.14,42.33 134.17,42.35 134.17,102.07 140.85,108.75 140.85,145.9 139.79,146.95 139.79,147.07 137.63,149.22 PCA9547.6 115.66,149.22 112.62,146.18 VL-R1.3
SDA2
  Top 0.305: 119.22,146.69 137.08,146.69 VL04.1
  Top 0.33: 119.22,146.69 PCA9547.4 115.98,146.69 113.75,144.45 VL-R1.1
SDA3
  Top 0.305: 108.93,157.02 109.44,157.53 VL-R2.1 | PCA9547.13 105.38,156.84 96.69,148.16 93.99,148.16 86.29,155.86 86.29,171.9 74.9,183.29 74.9,185.67 74.26,186.31 72.36,186.31 71.14,185.09 VL03.1
  Top 0.33: PCA9547.13 108.75,156.84 108.93,157.02
SDA4
  Top 0.305: 103.93,150.45 99.73,146.25 93.27,146.25 83.72,136.7 83.71,136.7 28.07,81.06 10.1,81.06 SERMO1.1 | 104.98,151.5 105.25,151.76 PCA9547.17 108.19,151.76
  Top 0.33: 103.93,150.45 104.98,151.5
  Top 0.406: VL-R3.1 111.2,148.75 108.19,151.76
SDA5  (via drill 0.35)
  Top 0.305: 110.06,155.3 110.57,155.81 VL-R2.3 | 103.3,151.76 98.72,147.19 92.8,147.19 83.4,137.79 68.05,137.79 68.04,137.79 v66.38,137.79
  Top 0.33: 103.3,151.76 105.84,154.31 PCA9547.15 109.06,154.31 110.06,155.3
  Bottom 0.305: v66.38,137.79 14.82,137.81 11.78,140.84 9.11,140.84 8.35,140.08 8.35,138.43 9.49,137.29 9.54,137.34 VL02.1
SDA6
  Top 0.305: 113.78,153.39 112.26,154.92 SERMO-R1.1 | VL05.1 138.73,42.72 140.3,41.15 140.3,39.37 139.79,38.86 137,38.86 135.11,40.75 135.11,101.64 141.79,108.32 141.79,146.38 140.56,147.61 140.54,147.61 136.39,151.76 PCA9547.8 115.41,151.76
  Top 0.33: 113.78,153.39 115.41,151.76
SDA7
  Top 0.305: VL-R3.3 110.08,147.32 108.17,149.22 PCA9547.19 105.2,149.22 101.08,145.1 93.67,145.1 93.67,145.09 93.47,145.09 18.26,69.88 18.26,39.62 13.4,34.77 VL01.1
SDA-D  (via drill 0.35)
  Top 0.61: PCA9547.23 v105.25,144.15 102.46,141.35 I2C-R2.1 | MAINCON.21 102.58,169.52 102.58,162.44 105.06,159.96 v112.87,159.96 132.44,159.96 I2C-R.P$3
  Bottom 0.508: v112.87,159.96 112.87,151.76 v105.25,144.15

### Text on the board
tPlace: SIG | 3.3 | 5 | G | 9 | SIG | SIG | SIG | SIG | SIG
bPlace: G | SIG | SIG | G